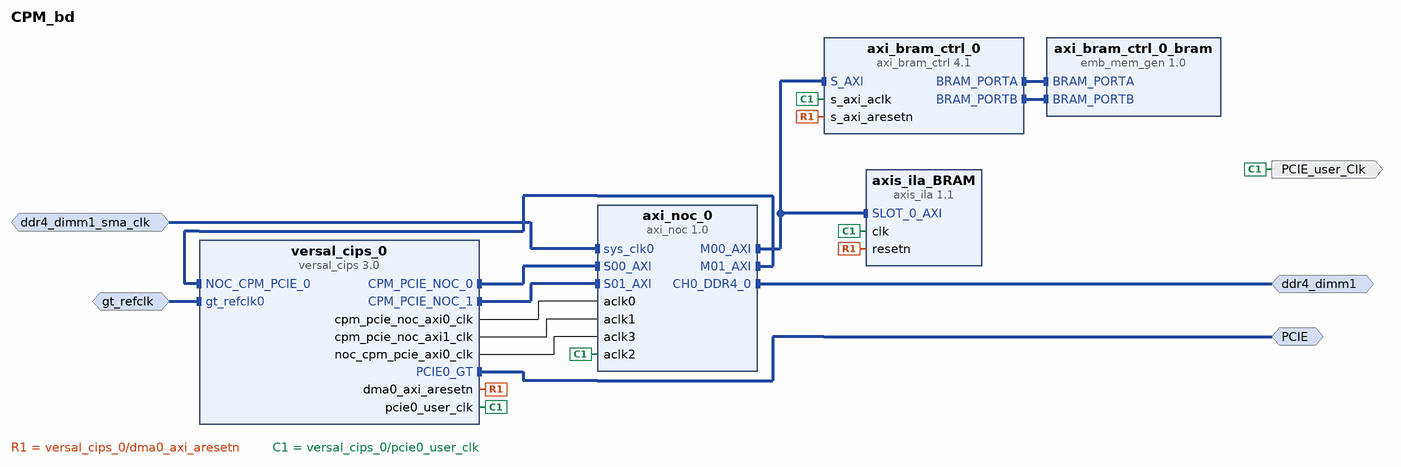
[diagram p0: block diagram of the top level]
# Vivado block design CPM_bd, xcvc1902-vsva2197-2MP-e-S, Vivado 2021.1
create_bd_design CPM_bd

create_bd_intf_port -mode Master -vlnv xilinx.com:interface:ddr4_rtl:1.0 ddr4_dimm1
create_bd_intf_port -mode Slave -vlnv xilinx.com:interface:diff_clock_rtl:1.0 ddr4_dimm1_sma_clk
set_property -dict {CONFIG.FREQ_HZ 200000000} [get_bd_intf_ports ddr4_dimm1_sma_clk]
create_bd_intf_port -mode Slave -vlnv xilinx.com:interface:diff_clock_rtl:1.0 gt_refclk
create_bd_intf_port -mode Master -vlnv xilinx.com:interface:gt_rtl:1.0 PCIE
create_bd_port -dir O -type clk PCIE_user_Clk

create_bd_cell -type ip -vlnv xilinx.com:ip:versal_cips:3.0 versal_cips_0
set_property -dict [list \
  CONFIG.CPM_CONFIG {CPM_AXI_SLV_BRIDGE_BASE_ADDRR_H 0x00000006 CPM_PCIE0_BRIDGE_AXI_SLAVE_IF 0 CPM_PCIE0_MAX_LINK_SPEED 16.0_GT/s CPM_PCIE0_MODES DMA CPM_PCIE0_MODE_SELECTION Advanced CPM_PCIE0_MSI_X_OPTIONS MSI-X_Internal CPM_PCIE0_PF0_BAR0_XDMA_TYPE DMA CPM_PCIE0_PF0_BAR1_XDMA_ENABLED 1 CPM_PCIE0_PF0_BAR1_XDMA_SCALE Megabytes CPM_PCIE0_PF0_BAR1_XDMA_SIZE 4 CPM_PCIE0_PF0_BAR2_XDMA_ENABLED 0 CPM_PCIE0_PF0_BAR2_XDMA_SCALE Bytes CPM_PCIE0_PF0_BAR2_XDMA_SIZE 128 CPM_PCIE0_PF0_PCIEBAR2AXIBAR_XDMA_1 0x0000020100000000 CPM_PCIE0_PF0_PCIEBAR2AXIBAR_XDMA_2 0x0000000000000000 CPM_PCIE0_PL_LINK_CAP_MAX_LINK_WIDTH X8 } \
  CONFIG.PS_PMC_CONFIG {DESIGN_MODE 1 PCIE_APERTURES_DUAL_ENABLE 0 PCIE_APERTURES_SINGLE_ENABLE 1 PS_BOARD_INTERFACE Custom PS_PCIE1_PERIPHERAL_ENABLE 1 PS_PCIE2_PERIPHERAL_ENABLE 0 PS_PCIE_EP_RESET1_IO {PMC_MIO 38} PS_PCIE_RESET {{ENABLE 1} {IO {PS_MIO 18 .. 19}}} SMON_ALARMS Set_Alarms_On SMON_ENABLE_TEMP_AVERAGING 0 SMON_TEMP_AVERAGING_SAMPLES 8 } \
  CONFIG.PS_PMC_CONFIG_APPLIED 1 \
] [get_bd_cells versal_cips_0]
create_bd_cell -type ip -vlnv xilinx.com:ip:axi_noc:1.0 axi_noc_0
set_property -dict [list \
  CONFIG.CH0_DDR4_0_BOARD_INTERFACE ddr4_dimm1 \
  CONFIG.MC1_CONFIG_NUM config17 \
  CONFIG.MC2_CONFIG_NUM config17 \
  CONFIG.MC3_CONFIG_NUM config17 \
  CONFIG.MC_BOARD_INTRF_EN true \
  CONFIG.MC_CASLATENCY 22 \
  CONFIG.MC_DDR4_2T Disable \
  CONFIG.MC_F1_LPDDR4_MR1 0x0000 \
  CONFIG.MC_F1_LPDDR4_MR2 0x0000 \
  CONFIG.MC_F1_LPDDR4_MR3 0x0000 \
  CONFIG.MC_F1_LPDDR4_MR11 0x0000 \
  CONFIG.MC_F1_LPDDR4_MR13 0x0000 \
  CONFIG.MC_F1_LPDDR4_MR22 0x0000 \
  CONFIG.MC_F1_TRCD 13750 \
  CONFIG.MC_F1_TRCDMIN 13750 \
  CONFIG.MC_TRC 45750 \
  CONFIG.MC_TRCD 13750 \
  CONFIG.MC_TRP 13750 \
  CONFIG.MC_TRPMIN 13750 \
  CONFIG.NUM_CLKS 4 \
  CONFIG.NUM_MC 1 \
  CONFIG.NUM_MCP 1 \
  CONFIG.NUM_MI 2 \
  CONFIG.NUM_SI 2 \
  CONFIG.sys_clk0_BOARD_INTERFACE ddr4_dimm1_sma_clk \
] [get_bd_cells axi_noc_0]
create_bd_cell -type ip -vlnv xilinx.com:ip:axi_bram_ctrl:4.1 axi_bram_ctrl_0
create_bd_cell -type ip -vlnv xilinx.com:ip:emb_mem_gen:1.0 axi_bram_ctrl_0_bram
set_property -dict {CONFIG.MEMORY_TYPE True_Dual_Port_RAM} [get_bd_cells axi_bram_ctrl_0_bram]
create_bd_cell -type ip -vlnv xilinx.com:ip:axis_ila:1.1 axis_ila_BRAM
set_property -dict [list \
  CONFIG.C_MON_TYPE Interface_Monitor \
  CONFIG.C_SLOT_0_AXI_R_SEL_TRIG 0 \
  CONFIG.C_SLOT_0_AXI_W_SEL_TRIG 0 \
] [get_bd_cells axis_ila_BRAM]

# ---- connections ----

connect_bd_intf_net [get_bd_intf_pins axi_bram_ctrl_0_bram/BRAM_PORTA] [get_bd_intf_pins axi_bram_ctrl_0/BRAM_PORTA]
connect_bd_intf_net [get_bd_intf_pins axi_bram_ctrl_0_bram/BRAM_PORTB] [get_bd_intf_pins axi_bram_ctrl_0/BRAM_PORTB]
connect_bd_intf_net [get_bd_intf_ports ddr4_dimm1] [get_bd_intf_pins axi_noc_0/CH0_DDR4_0]
connect_bd_intf_net [get_bd_intf_pins axi_noc_0/M00_AXI] [get_bd_intf_pins axi_bram_ctrl_0/S_AXI]
connect_bd_intf_net [get_bd_intf_pins axi_noc_0/M00_AXI] [get_bd_intf_pins axis_ila_BRAM/SLOT_0_AXI]
connect_bd_intf_net [get_bd_intf_pins versal_cips_0/NOC_CPM_PCIE_0] [get_bd_intf_pins axi_noc_0/M01_AXI]
connect_bd_intf_net [get_bd_intf_ports ddr4_dimm1_sma_clk] [get_bd_intf_pins axi_noc_0/sys_clk0]
connect_bd_intf_net -intf_net gt_refclk0_0_1 [get_bd_intf_ports gt_refclk] [get_bd_intf_pins versal_cips_0/gt_refclk0]
connect_bd_intf_net [get_bd_intf_pins versal_cips_0/CPM_PCIE_NOC_0] [get_bd_intf_pins axi_noc_0/S00_AXI]
connect_bd_intf_net [get_bd_intf_pins versal_cips_0/CPM_PCIE_NOC_1] [get_bd_intf_pins axi_noc_0/S01_AXI]
connect_bd_intf_net [get_bd_intf_ports PCIE] [get_bd_intf_pins versal_cips_0/PCIE0_GT]
connect_bd_net [get_bd_pins versal_cips_0/cpm_pcie_noc_axi0_clk] [get_bd_pins axi_noc_0/aclk0]
connect_bd_net [get_bd_pins versal_cips_0/cpm_pcie_noc_axi1_clk] [get_bd_pins axi_noc_0/aclk1]
connect_bd_net [get_bd_pins versal_cips_0/dma0_axi_aresetn] [get_bd_pins axi_bram_ctrl_0/s_axi_aresetn] [get_bd_pins axis_ila_BRAM/resetn]
connect_bd_net [get_bd_pins versal_cips_0/noc_cpm_pcie_axi0_clk] [get_bd_pins axi_noc_0/aclk3]
connect_bd_net [get_bd_pins versal_cips_0/pcie0_user_clk] \
  [get_bd_pins axi_bram_ctrl_0/s_axi_aclk] [get_bd_pins axi_noc_0/aclk2] [get_bd_pins axis_ila_BRAM/clk] \
  [get_bd_ports PCIE_user_Clk]

# ---- address map ----
assign_bd_address -offset 0x0000000000000000 -range 2G -target_address_space [get_bd_addr_spaces versal_cips_0/CPM_PCIE_NOC_0] [get_bd_addr_segs axi_noc_0/S00_AXI/C0_DDR_LOW0]
assign_bd_address -offset 0x00000000E0000000 -range 256M -target_address_space [get_bd_addr_spaces versal_cips_0/CPM_PCIE_NOC_0] [get_bd_addr_segs versal_cips_0/NOC_CPM_PCIE_0/pspmc_0_psv_noc_pcie_0]
assign_bd_address -offset 0x0000000600000000 -range 8G -target_address_space [get_bd_addr_spaces versal_cips_0/CPM_PCIE_NOC_0] [get_bd_addr_segs versal_cips_0/NOC_CPM_PCIE_0/pspmc_0_psv_noc_pcie_1]
assign_bd_address -offset 0x0000008000000000 -range 256G -target_address_space [get_bd_addr_spaces versal_cips_0/CPM_PCIE_NOC_0] [get_bd_addr_segs versal_cips_0/NOC_CPM_PCIE_0/pspmc_0_psv_noc_pcie_2]
assign_bd_address -offset 0x0000020100000000 -range 8K -target_address_space [get_bd_addr_spaces versal_cips_0/CPM_PCIE_NOC_0] [get_bd_addr_segs axi_bram_ctrl_0/S_AXI/Mem0]
assign_bd_address -offset 0x0000000000000000 -range 2G -target_address_space [get_bd_addr_spaces versal_cips_0/CPM_PCIE_NOC_1] [get_bd_addr_segs axi_noc_0/S01_AXI/C0_DDR_LOW0]
assign_bd_address -offset 0x00000000E0000000 -range 256M -target_address_space [get_bd_addr_spaces versal_cips_0/CPM_PCIE_NOC_1] [get_bd_addr_segs versal_cips_0/NOC_CPM_PCIE_0/pspmc_0_psv_noc_pcie_0]
assign_bd_address -offset 0x0000000600000000 -range 8G -target_address_space [get_bd_addr_spaces versal_cips_0/CPM_PCIE_NOC_1] [get_bd_addr_segs versal_cips_0/NOC_CPM_PCIE_0/pspmc_0_psv_noc_pcie_1]
assign_bd_address -offset 0x0000008000000000 -range 256G -target_address_space [get_bd_addr_spaces versal_cips_0/CPM_PCIE_NOC_1] [get_bd_addr_segs versal_cips_0/NOC_CPM_PCIE_0/pspmc_0_psv_noc_pcie_2]
assign_bd_address -offset 0x0000020100000000 -range 8K -target_address_space [get_bd_addr_spaces versal_cips_0/CPM_PCIE_NOC_1] [get_bd_addr_segs axi_bram_ctrl_0/S_AXI/Mem0]

validate_bd_design
save_bd_design
